# EAGLE schematic EVO256x64 (EAGLE 7.4.0)
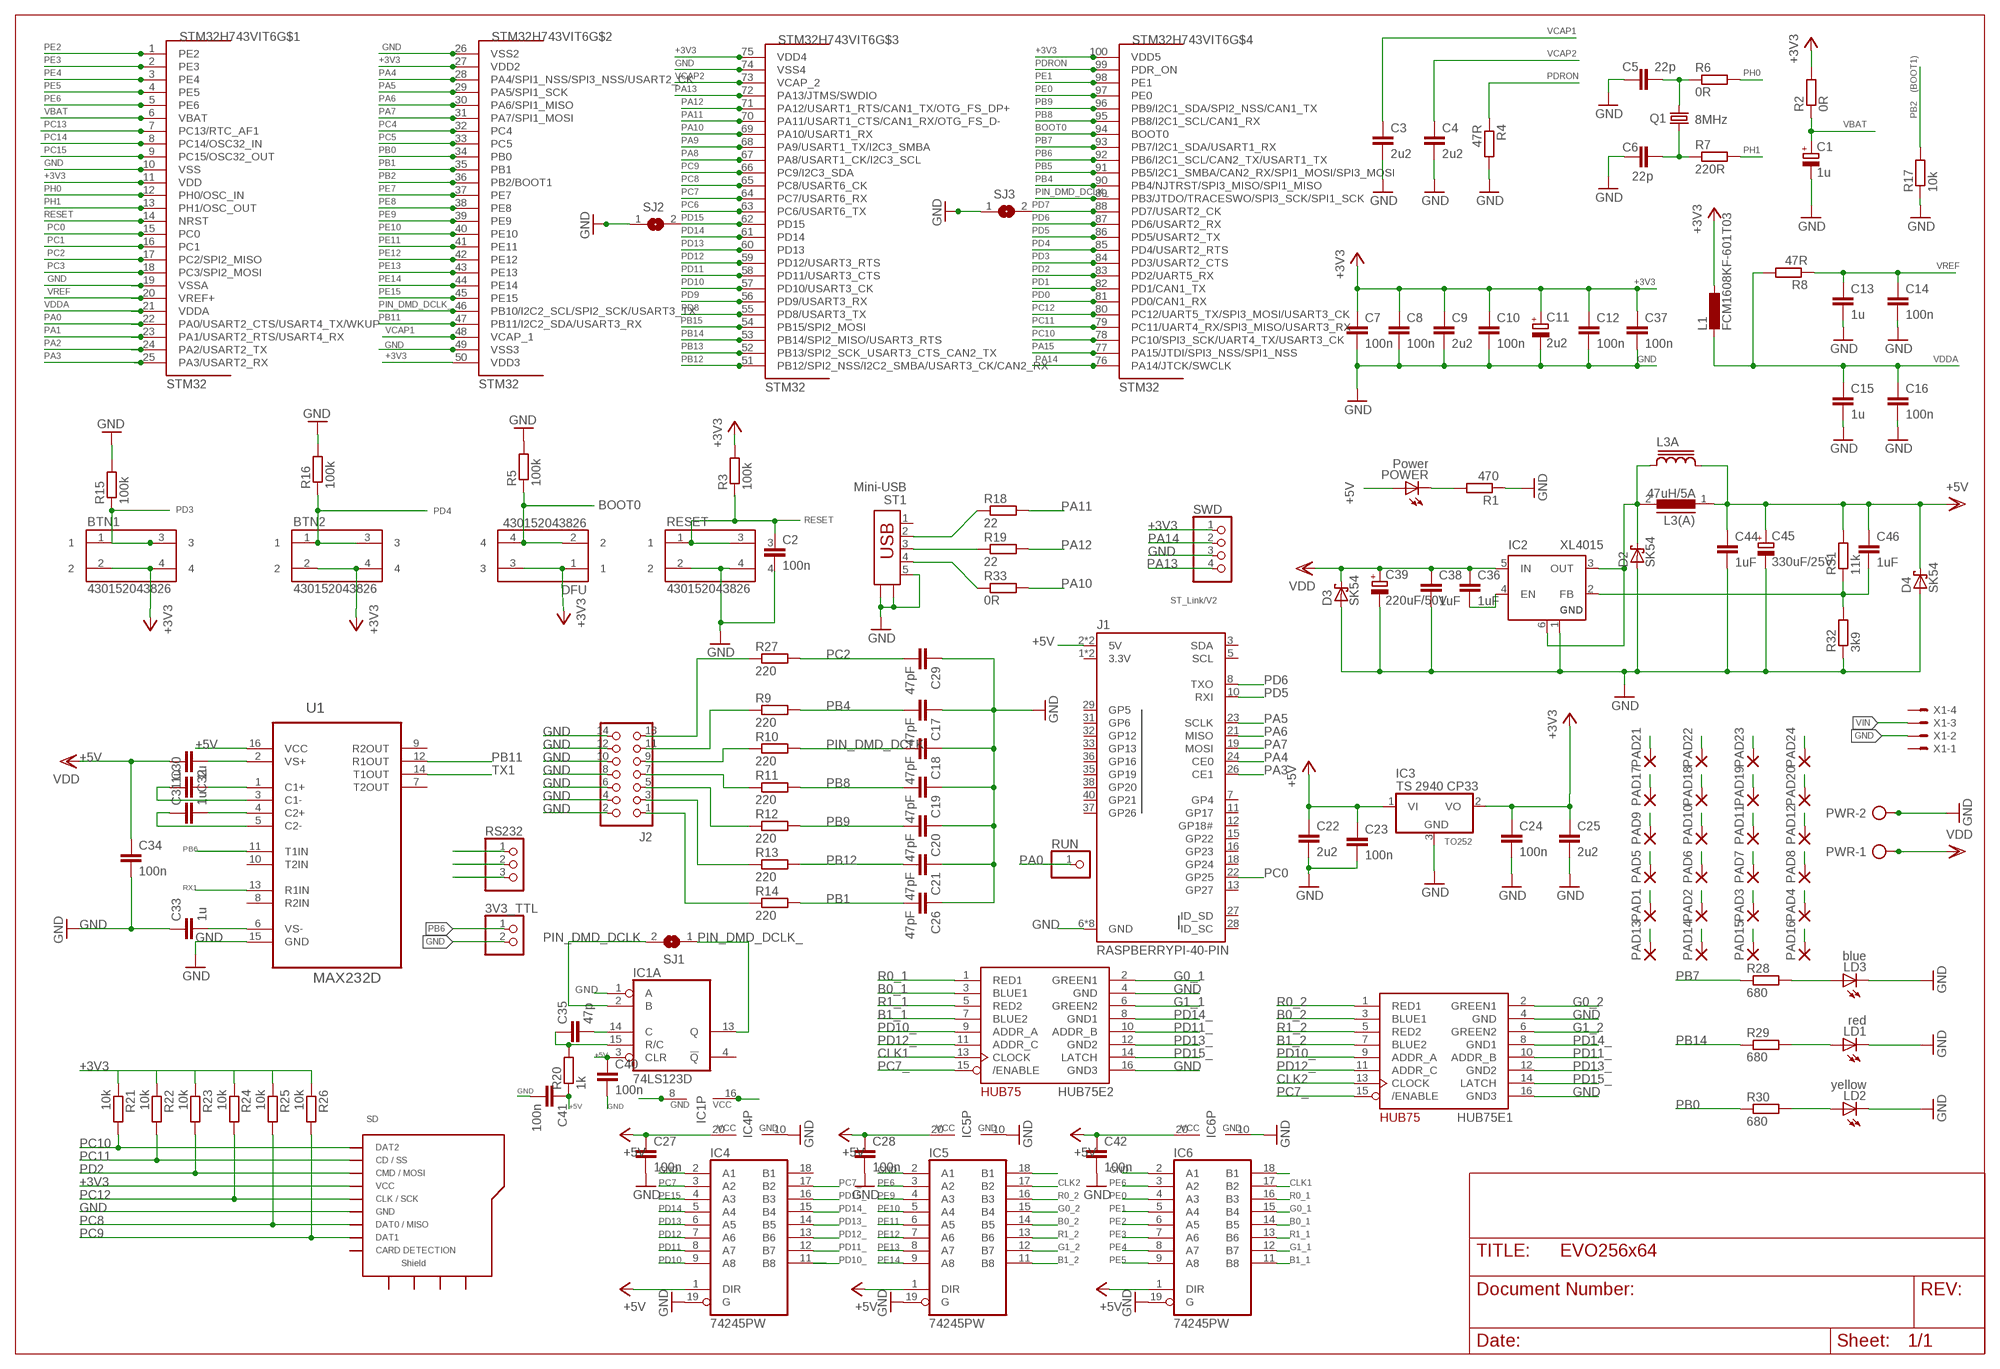
[diagram p0: schematic, sheet 1]

## Parts
3V3_TTL  PINHD-1X2  [1X02]
BTN1  430152043826  [430152043826]
BTN2  430152043826  [430152043826]
C1  1u  CPOL-EUCT3528  [CT3528]
C2  100n  C-EUC0805  [C0805]
C3  2u2  C-EUC0805  [C0805]
C4  2u2  C-EUC0805  [C0805]
C5  22p  C-EUC0805  [C0805]
C6  22p  C-EUC0805  [C0805]
C7  100n  C-EUC0805  [C0805]
C8  100n  C-EUC0805  [C0805]
C9  2u2  C-EUC1206  [C1206]
C10  100n  C-EUC0805  [C0805]
C11  2u2  CPOL-EUCT3528  [CT3528]
C12  100n  C-EUC0805  [C0805]
C13  1u  C-EUC1206  [C1206]
C14  100n  C-EUC0805  [C0805]
C15  1u  C-EUC1206  [C1206]
C16  100n  C-EUC0805  [C0805]
C17  47pF  C-EUC0805  [C0805]
C18  47pF  C-EUC0805  [C0805]
C19  47pF  C-EUC0805  [C0805]
C20  47pF  C-EUC0805  [C0805]
C21  47pF  C-EUC0805  [C0805]
C22  2u2  C-EUC1206  [C1206]
C23  100n  C-EUC0805  [C0805]
C24  100n  C-EUC0805  [C0805]
C25  2u2  C-EUC1206  [C1206]
C26  47pF  C-EUC0805  [C0805]
C27  100n  C-EUC0805  [C0805]
C28  100n  C-EUC0805  [C0805]
C29  47pF  C-EUC0805  [C0805]
C30  1u  C-EUC0805  [C0805]
C31  1u  C-EUC0805  [C0805]
C32  1u  C-EUC0805  [C0805]
C33  1u  C-EUC0805  [C0805]
C34  100n  C-EUC0805  [C0805]
C35  47p  C-EUC0805  [C0805]
C36  1uF  C-EUC1206  [C1206]
C37  100n  C-EUC0805  [C0805]
C38  1uF  C-EUC1206  [C1206]
C39  220uF/50V  CPOL-EUG  [PANASONIC_G]
C40  100n  C-EUC0805  [C0805]
C41  100n  C-EUC0805  [C0805]
C42  100n  C-EUC0805  [C0805]
C44  1uF  C-EUC1206  [C1206]
C45  330uF/25V  CPOL-EUG  [PANASONIC_G]
C46  1uF  C-EUC1206  [C1206]
D2  SK54  SCHOTTKY-DIODESMD  [SMB]
D3  SK54  SCHOTTKY-DIODESMD  [SMB]
D4  SK54  SCHOTTKY-DIODESMD  [SMB]
DFU  430152043826  [430152043826]
HUB75E1  RGB  HUB75MATRIX  [2X08-IDC]
HUB75E2  RGB  HUB75MATRIX  [2X08-IDC]
IC1  74LS123D  [SO16]
IC2  XL4015  [TO263-5]
IC3  TS 2940 CP33  7808DT  [TO252]
IC4  74245PW  [TSSOP20]
IC5  74245PW  [TSSOP20]
IC6  74245PW  [TSSOP20]
J1  RASPBERRYPI-40-PIN  RASPBERRYPI-40-PIN-GPIO_PTH_NO_SHROUD  [2X20]
J2  CON_HEADER_2X07-PTH-SHROUDED  [PINSHRD_PTH_2X07]
L1  FCM1608KF-601T03  L-EUL2012C  [L2012C]
L3(A)  47uH/5A  ED16  [ED16]
L3A  SRR1206  [SRR1206]
LD1  red  LEDCHIP-LED0805  [CHIP-LED0805]
LD2  yellow  LEDCHIP-LED0805  [CHIP-LED0805]
LD3  blue  LEDCHIP-LED0805  [CHIP-LED0805]
PAD1  SMD5  [SMD2,54-5,08]
PAD2  SMD5  [SMD2,54-5,08]
PAD3  SMD5  [SMD2,54-5,08]
PAD4  SMD5  [SMD2,54-5,08]
PAD5  SMD5  [SMD2,54-5,08]
PAD6  SMD5  [SMD2,54-5,08]
PAD7  SMD5  [SMD2,54-5,08]
PAD8  SMD5  [SMD2,54-5,08]
PAD9  SMD5  [SMD2,54-5,08]
PAD10  SMD5  [SMD2,54-5,08]
PAD11  SMD5  [SMD2,54-5,08]
PAD12  SMD5  [SMD2,54-5,08]
PAD13  SMD5  [SMD2,54-5,08]
PAD14  SMD5  [SMD2,54-5,08]
PAD15  SMD5  [SMD2,54-5,08]
PAD16  SMD5  [SMD2,54-5,08]
PAD17  SMD5  [SMD2,54-5,08]
PAD18  SMD5  [SMD2,54-5,08]
PAD19  SMD5  [SMD2,54-5,08]
PAD20  SMD5  [SMD2,54-5,08]
PAD21  SMD5  [SMD2,54-5,08]
PAD22  SMD5  [SMD2,54-5,08]
PAD23  SMD5  [SMD2,54-5,08]
PAD24  SMD5  [SMD2,54-5,08]
POWER  Power  LEDCHIPLED_0805  [CHIPLED_0805]
PWR  AK500/2-H  [AK500/2-H]
Q1  8MHz  CRYSTALHC49UP  [HC49UP]
R1  470  R-EU_R0805  [R0805]
R2  0R  R-EU_R0805  [R0805]
R3  100k  R-EU_R0805  [R0805]
R4  47R  R-EU_R0805  [R0805]
R5  100k  R-EU_R0805  [R0805]
R6  0R  R-EU_R0805  [R0805]
R7  220R  R-EU_R0805  [R0805]
R8  47R  R-EU_R0805  [R0805]
R9  220  R-EU_R0805  [R0805]
R10  220  R-EU_R0805  [R0805]
R11  220  R-EU_R0805  [R0805]
R12  220  R-EU_R0805  [R0805]
R13  220  R-EU_R0805  [R0805]
R14  220  R-EU_R0805  [R0805]
R15  100k  R-EU_R0805  [R0805]
R16  100k  R-EU_R0805  [R0805]
R17  10k  R-EU_R0805  [R0805]
R18  22  R-EU_R0805  [R0805]
R19  22  R-EU_R0805  [R0805]
R20  1k  R-EU_R0805  [R0805]
R21  10k  R-EU_R0805  [R0805]
R22  10k  R-EU_R0805  [R0805]
R23  10k  R-EU_R0805  [R0805]
R24  10k  R-EU_R0805  [R0805]
R25  10k  R-EU_R0805  [R0805]
R26  10k  R-EU_R0805  [R0805]
R27  220  R-EU_R0805  [R0805]
R28  680  R-EU_R0805  [R0805]
R29  680  R-EU_R0805  [R0805]
R30  680  R-EU_R0805  [R0805]
R31  11k  R-EU_R1206  [R1206]
R32  3k9  R-EU_R1206  [R1206]
R33  0R  R-EU_R0805  [R0805]
RESET  430152043826  [430152043826]
RS232  PINHD-1X3  [1X03]
RUN  PINHD-1X1  [1X01]
SD  MICROSD_CARD_POLLIN  [MR**-AP*03**]
SJ1  SJ  [SJ]
SJ2  SJ  [SJ]
SJ3  SJ  [SJ]
ST1  Mini-USB  UBS-MINI  [USBMINI]
STM32H743VIT6  STM32  STM32F7  [LQFP100]
SWD  PINHD-1X4  [1X04]
U1  MAX232D  [SOIC127P600X175-16N]
X1  KK-156-4  [KK-156-4]

## Nets
+3V3: BTN1.2 BTN1.4 BTN2.2 BTN2.4 C7.1 C8.1 C9.1 C10.1 C11.+ C12.1 C24.1 C25.1 C37.1 DFU.1 DFU.3 IC3.2(VO) L1.1 R2.2 R3.2 R21.1 R22.1 R23.1 R24.1 R25.1 R26.1 SD.VCC STM32H743VIT6.11(VDD) STM32H743VIT6.27(VDD2) STM32H743VIT6.50(VDD3) STM32H743VIT6.75(VDD4) STM32H743VIT6.100(VDD5) SWD.1
+5V: C22.1 C23.1 C27.1 C28.1 C32.2 C34.1 C40.1 C41.1 C42.1 C44.1 C45.+ C46.1 D4.C IC1.3(A:CLR) IC1.16(P:VCC) IC3.1(VI) IC4.1(DIR) IC4.20(VCC) IC5.1(DIR) IC5.20(VCC) IC6.1(DIR) IC6.20(VCC) J1.2(5V) J1.4(5V) L3(A).1 L3A.2 PAD1.1(P) PAD2.1(P) PAD5.1(P) PAD6.1(P) PAD9.1(P) PAD10.1(P) PAD13.1(P) PAD14.1(P) PAD17.1(P) PAD18.1(P) PAD21.1(P) PAD22.1(P) POWER.A R20.1 R31.2 U1.16(VCC) ; supply symbol labelled VDD
B0_1: HUB75E2.3(BLUE1) IC6.14(B5)
B0_2: HUB75E1.3(BLUE1) IC5.14(B5)
B1_1: HUB75E2.7(BLUE2) IC6.11(B8)
B1_2: HUB75E1.7(BLUE2) IC5.11(B8)
BOOT0: DFU.2 DFU.4 R5.1 STM32H743VIT6.94(BOOT0)
CLK1: HUB75E2.13(CLOCK) IC6.17(B2)
CLK2: HUB75E1.13(CLOCK) IC5.17(B2)
G0_1: HUB75E2.2(GREEN1) IC6.15(B4)
G0_2: HUB75E1.2(GREEN1) IC5.15(B4)
G1_1: HUB75E2.6(GREEN2) IC6.12(B7)
G1_2: HUB75E1.6(GREEN2) IC5.12(B7)
GND: 3V3_TTL.2 C1.- C2.2 C3.2 C4.2 C5.2 C6.2 C7.2 C8.2 C9.2 C10.2 C11.- C12.2 C13.2 C14.2 C15.2 C16.2 C17.1 C18.1 C19.1 C20.1 C21.1 C22.2 C23.2 C24.2 C25.2 C26.1 C27.2 C28.2 C29.1 C33.1 C34.2 C37.2 C38.2 C39.- C40.2 C41.2 C42.2 C44.2 C45.- D2.A D3.A D4.A HUB75E1.4(GND) HUB75E1.16(GND3) HUB75E2.4(GND) HUB75E2.16(GND3) IC1.1(A:A) IC1.8(P:GND) IC2.1(GND) IC3.3(GND) IC4.2(A1) IC4.10(GND) IC4.19(G) IC5.2(A1) IC5.10(GND) IC5.19(G) IC6.2(A1) IC6.10(GND) IC6.19(G) J1.6(GND) J1.9(GND) J1.14(GND) J1.20(GND) J1.25(GND) J1.30(GND) J1.34(GND) J1.39(GND) J2.2 J2.4 J2.6 J2.8 J2.10 J2.12 J2.14 LD1.C LD2.C LD3.C PAD3.1(P) PAD4.1(P) PAD7.1(P) PAD8.1(P) PAD11.1(P) PAD12.1(P) PAD15.1(P) PAD16.1(P) PAD19.1(P) PAD20.1(P) PAD23.1(P) PAD24.1(P) PWR.2 R1.1 R4.2 R5.2 R15.2 R16.2 R17.1 R32.1 RESET.2 RESET.4 RS232.2 SD.GND SJ2.1 SJ3.1 ST1.5 ST1.N1 ST1.N2 STM32H743VIT6.10(VSS) STM32H743VIT6.19(VSSA) STM32H743VIT6.26(VSS2) STM32H743VIT6.49(VSS3) STM32H743VIT6.54(PB15/SPI2_MOSI) STM32H743VIT6.74(VSS4) SWD.3 U1.15(GND) X1.2
N$1: C5.1 Q1.2 R6.1
N$2: C6.1 Q1.1 R7.1
N$3: POWER.C R1.2
N$4: J2.13 R27.1
N$5: J2.11 R9.1
N$6: J2.9 R10.1
N$7: J2.7 R11.1
N$8: J2.5 R12.1
N$9: J2.3 R13.1
N$10: C35.1 IC1.15(A:R/C) R20.2
N$11: J2.1 R14.1
N$13: C30.2 U1.1(C1+)
N$14: C30.1 U1.3(C1-)
N$15: C31.2 U1.4(C2+)
N$16: C31.1 U1.5(C2-)
N$17: C33.2 U1.6(VS-)
N$18: C32.1 U1.2(VS+)
N$19: LD1.A R29.2
N$20: D2.C IC2.3(OUT) IC2.6(TAB) L3(A).2 L3A.1
N$21: C46.2 IC2.2(FB) R31.1 R32.2
N$22: C35.2 IC1.14(A:C)
N$23: LD3.A R28.2
N$24: C36.2 IC2.4(EN)
N$25: R33.1 ST1.4
N$26: LD2.A R30.2
N$39: R19.1 ST1.3
N$40: R18.1 ST1.2
N$45: IC6.18(B1)
N$62: IC5.18(B1)
PA0: RUN.1 STM32H743VIT6.22(PA0/USART2_CTS/USART4_TX/WKUP)
PA1: STM32H743VIT6.23(PA1/USART2_RTS/USART4_RX)
PA2: STM32H743VIT6.24(PA2/USART2_TX)
PA3: J1.26(CE1) STM32H743VIT6.25(PA3/USART2_RX)
PA4: J1.24(CE0) STM32H743VIT6.28(PA4/SPI1_NSS/SPI3_NSS/USART2_CK)
PA5: J1.23(SCLK) STM32H743VIT6.29(PA5/SPI1_SCK)
PA6: J1.21(MISO) STM32H743VIT6.30(PA6/SPI1_MISO)
PA7: J1.19(MOSI) STM32H743VIT6.31(PA7/SPI1_MOSI)
PA8: STM32H743VIT6.67(PA8/USART1_CK/I2C3_SCL)
PA9: STM32H743VIT6.68(PA9/USART1_TX/I2C3_SMBA)
PA10: R33.2 STM32H743VIT6.69(PA10/USART1_RX)
PA11: R18.2 STM32H743VIT6.70(PA11/USART1_CTS/CAN1_RX/OTG_FS_D-)
PA12: R19.2 STM32H743VIT6.71(PA12/USART1_RTS/CAN1_TX/OTG_FS_DP+)
PA13: STM32H743VIT6.72(PA13/JTMS/SWDIO) SWD.4
PA14: STM32H743VIT6.76(PA14/JTCK/SWCLK) SWD.2
PA15: STM32H743VIT6.77(PA15/JTDI/SPI3_NSS/SPI1_NSS)
PB0: R30.1 STM32H743VIT6.34(PB0)
PB1: C26.2 R14.2 STM32H743VIT6.35(PB1)
PB2: R17.2 STM32H743VIT6.36(PB2/BOOT1)
PB4: C17.2 R9.2 STM32H743VIT6.90(PB4/NJTRST/SPI3_MISO/SPI1_MISO)
PB5: STM32H743VIT6.91(PB5/I2C1_SMBA/CAN2_RX/SPI1_MOSI/SPI3_MOSI)
PB6: 3V3_TTL.1 STM32H743VIT6.92(PB6/I2C1_SCL/CAN2_TX/USART1_TX) U1.11(T1IN)
PB7: R28.1 STM32H743VIT6.93(PB7/I2C1_SDA/USART1_RX)
PB8: C19.2 R11.2 STM32H743VIT6.95(PB8/I2C1_SCL/CAN1_RX)
PB9: C20.2 R12.2 STM32H743VIT6.96(PB9/I2C1_SDA/SPI2_NSS/CAN1_TX)
PB11: STM32H743VIT6.47(PB11/I2C2_SDA/USART3_RX) U1.12(R1OUT)
PB12: C21.2 R13.2 STM32H743VIT6.51(PB12/SPI2_NSS/I2C2_SMBA/USART3_CK/CAN2_RX)
PB13: STM32H743VIT6.52(PB13/SPI2_SCK_USART3_CTS_CAN2_TX)
PB14: R29.1 STM32H743VIT6.53(PB14/SPI2_MISO/USART3_RTS)
PC0: J1.22(GP25) STM32H743VIT6.15(PC0)
PC1: STM32H743VIT6.16(PC1)
PC2: C29.2 R27.2 STM32H743VIT6.17(PC2/SPI2_MISO)
PC3: STM32H743VIT6.18(PC3/SPI2_MOSI)
PC4: STM32H743VIT6.32(PC4)
PC5: STM32H743VIT6.33(PC5)
PC6: STM32H743VIT6.63(PC6/USART6_TX)
PC7: IC4.3(A2) STM32H743VIT6.64(PC7/USART6_RX)
PC7_: HUB75E1.15(/ENABLE) HUB75E2.15(/ENABLE) IC4.17(B2)
PC8: R25.2 SD.DAT0(DAT0/MISO) STM32H743VIT6.65(PC8/USART6_CK)
PC9: R26.2 SD.DAT1 STM32H743VIT6.66(PC9/I2C3_SDA)
PC10: R21.2 SD.DAT2 STM32H743VIT6.78(PC10/SPI3_SCK/UART4_TX/USART3_CK)
PC11: R22.2 SD.DAT3/CS(CD/SS) STM32H743VIT6.79(PC11/UART4_RX/SPI3_MISO/USART3_RX)
PC12: R24.2 SD.CLK(CLK/SCK) STM32H743VIT6.80(PC12/UART5_TX/SPI3_MOSI/USART3_CK)
PC13: STM32H743VIT6.7(PC13/RTC_AF1)
PC14: STM32H743VIT6.8(PC14/OSC32_IN)
PC15: STM32H743VIT6.9(PC15/OSC32_OUT)
PD0: STM32H743VIT6.81(PD0/CAN1_RX)
PD1: STM32H743VIT6.82(PD1/CAN1_TX)
PD2: R23.2 SD.CMD(CMD/MOSI) STM32H743VIT6.83(PD2/UART5_RX)
PD3: BTN1.1 BTN1.3 R15.1 STM32H743VIT6.84(PD3/USART2_CTS)
PD4: BTN2.1 BTN2.3 R16.1 STM32H743VIT6.85(PD4/USART2_RTS)
PD5: J1.10(RXI) STM32H743VIT6.86(PD5/USART2_TX)
PD6: J1.8(TXO) STM32H743VIT6.87(PD6/USART2_RX)
PD7: SJ3.2 STM32H743VIT6.88(PD7/USART2_CK)
PD8: STM32H743VIT6.55(PD8/USART3_TX)
PD9: STM32H743VIT6.56(PD9/USART3_RX)
PD10: IC4.9(A8) STM32H743VIT6.57(PD10/USART3_CK)
PD10_: HUB75E1.9(ADDR_A) HUB75E2.9(ADDR_A) IC4.11(B8)
PD11: IC4.8(A7) STM32H743VIT6.58(PD11/USART3_CTS)
PD11_: HUB75E1.10(ADDR_B) HUB75E2.10(ADDR_B) IC4.12(B7)
PD12: IC4.7(A6) STM32H743VIT6.59(PD12/USART3_RTS)
PD12_: HUB75E1.11(ADDR_C) HUB75E2.11(ADDR_C) IC4.13(B6)
PD13: IC4.6(A5) STM32H743VIT6.60(PD13)
PD13_: HUB75E1.12(GND2) HUB75E2.12(GND2) IC4.14(B5)
PD14: IC4.5(A4) STM32H743VIT6.61(PD14)
PD14_: HUB75E1.8(GND1) HUB75E2.8(GND1) IC4.15(B4)
PD15: SJ2.2 STM32H743VIT6.62(PD15)
PD15_: HUB75E1.14(LATCH) HUB75E2.14(LATCH) IC4.16(B3)
PDRON: R4.1 STM32H743VIT6.99(PDR_ON)
PE0: IC6.4(A3) STM32H743VIT6.97(PE0)
PE1: IC6.5(A4) STM32H743VIT6.98(PE1)
PE2: IC6.6(A5) STM32H743VIT6.1(PE2)
PE3: IC6.7(A6) STM32H743VIT6.2(PE3)
PE4: IC6.8(A7) STM32H743VIT6.3(PE4)
PE5: IC6.9(A8) STM32H743VIT6.4(PE5)
PE6: IC5.3(A2) IC6.3(A2) STM32H743VIT6.5(PE6)
PE7: STM32H743VIT6.37(PE7)
PE8: STM32H743VIT6.38(PE8)
PE9: IC5.4(A3) STM32H743VIT6.39(PE9)
PE10: IC5.5(A4) STM32H743VIT6.40(PE10)
PE11: IC5.6(A5) STM32H743VIT6.41(PE11)
PE12: IC5.7(A6) STM32H743VIT6.42(PE12)
PE13: IC5.8(A7) STM32H743VIT6.43(PE13)
PE14: IC5.9(A8) STM32H743VIT6.44(PE14)
PE15: IC4.4(A3) STM32H743VIT6.45(PE15)
PH0: R6.2 STM32H743VIT6.12(PH0/OSC_IN)
PH1: R7.2 STM32H743VIT6.13(PH1/OSC_OUT)
PIN_DMD_DCLK: C18.2 IC1.2(A:B) R10.2 SJ1.2
PIN_DMD_DCLK_: IC1.13(A:Q) SJ1.1 STM32H743VIT6.46(PB10/I2C2_SCL/SPI2_SCK/USART3_TX) STM32H743VIT6.89(PB3/JTDO/TRACESWO/SPI3_SCK/SPI1_SCK)
R0_1: HUB75E2.1(RED1) IC6.16(B3)
R0_2: HUB75E1.1(RED1) IC5.16(B3)
R1_1: HUB75E2.5(RED2) IC6.13(B6)
R1_2: HUB75E1.5(RED2) IC5.13(B6)
RESET: C2.1 R3.1 RESET.1 RESET.3 STM32H743VIT6.14(NRST)
RX1: RS232.3 U1.13(R1IN)
TX1: RS232.1 U1.14(T1OUT)
VBAT: C1.+ R2.1 STM32H743VIT6.6(VBAT)
VCAP1: C3.1 STM32H743VIT6.48(VCAP_1)
VCAP2: C4.1 STM32H743VIT6.73(VCAP_2)
VDDA: C15.1 C16.1 L1.2 R8.2 STM32H743VIT6.21(VDDA)
VIN: C36.1 C38.1 C39.+ D3.C IC2.5(IN) PWR.1 X1.3 ; supply symbol labelled VDD
VREF: C13.1 C14.1 R8.1 STM32H743VIT6.20(VREF+)
Unconnected: IC1.4(A:!Q) IC1.5(B:Q) IC1.6(B:C) IC1.7(B:R/C) IC1.9(B:A) IC1.10(B:B) IC1.11(B:CLR) IC1.12(B:!Q) IC4.18(B1) J1.3(SDA) J1.5(SCL) J1.7(GP4) J1.11(GP17) J1.12(GP18#) J1.13(GP27) J1.15(GP22) J1.16(GP23) J1.18(GP24) J1.27(ID_SD) J1.28(ID_SC) J1.29(GP5) J1.31(GP6) J1.32(GP12) J1.33(GP13) J1.35(GP19) J1.36(GP16) J1.37(GP26) J1.38(GP20) J1.40(GP21) SD.CARD_DETECTION(CARD_D) SD.SHD_1(SHD1) SD.SHD_2(SHD2) SD.SHD_3(SHD3) SD.SHD_4(SHD4) ST1.1 U1.7(T2OUT) U1.8(R2IN) U1.9(R2OUT) U1.10(T2IN) X1.1 X1.4

## Notes on the sheet
- (BOOT1)
- PB15
- ST_Link/V2
- TO252

## Power pins joined to a net without a drawn wire
3.3V: J1.1(3.3V) J1.17(3.3V)

## Library data of the parts
3V3_TTL = pinhead:PINHD-1X2: PIN HEADER
BTN1 BTN2 DFU RESET = Switches_rev16a:430152043826: WS-TSS-6x6 mm SMD Tact Switch,4 pins
C1 C11 = rcl:CPOL-EU: POLARIZED CAPACITOR, European symbol
C2 C5-C8 C10 C12 C16 C23 C24 C37 = rcl:C-EU: CAPACITOR, European symbol
C3 C4 C9 C13-C15 C17-C22 C25-C36 C38 C40-C42 C44 C46 = resistor:C-EU: CAPACITOR, European symbol
C39 C45 = resistor:CPOL-EU: POLARIZED CAPACITOR, European symbol
D2-D4 = diode:SCHOTTKY-DIODE: Schottky Diode
HUB75E1 HUB75E2 = adafruit:HUB75MATRIX
IC1 = 74xx-eu:74*123: Retriggerable monostable MULTIVIBRATOR
IC2 = linear4:XL4015
IC3 = linear:78*: Positive VOLTAGE REGULATOR Source: http://cache.national.com/ds/LM/LM78L05.pdf http://www.fairchildsemi.com/ds/LM/LM7805.pdf
IC4-IC6 = 74xx-eu:74*245: Octal BUS TRANSCEIVER, 3-state
J1 = SparkFun-Connectors:RASPBERRYPI-40-PIN-GPIO: Raspberry Pi GPIO Header 2x20 pin connector, as found on B, B+, A+ models. Both shrouded PTH and SMT versions available. SparkFun Products: GPIO Shrouded Header <https://www.sparkfun.com/products/13054>- PTH SparkFun Pi Wedge (Preassembled) <https://www.sparkfun.com/products/13717>
J2 = dp_devices.v6:CON_HEADER_2X07: 2x07 pin header
L1 = rcl:L-EU: INDUCTOR, European symbol
L3(A) = inductors:ED16: INDUCTOR
L3A = inductor-bourns:SRR1206: POWER INDUCTOR
LD1-LD3 = adafruit:LED: LED
PAD1-PAD24 = wirepad:SMD5: SMD PAD
POWER = led:LED: LED
PWR = con-ptr500:AK500/2-H: CONNECTOR Aug. 2004 / PTR Meßtechnik: Die Bezeichnung der Serie AK505 wurde geändert. Es handelt sich hierbei um AK500 in horizontaler Ausführung.; OC_FARNELL: unknown; OC_NEWARK: unknown
Q1 = crystal:CRYSTAL: CRYSTAL; OC_FARNELL: unknown; OC_NEWARK: unknown
R1 R2 R4 R6-R8 R17 R20 = rcl:R-EU_: RESISTOR, European symbol
R3 R5 R9-R16 R18 R19 R21-R33 = resistor:R-EU_: RESISTOR, European symbol
RS232 = pinhead:PINHD-1X3: PIN HEADER
RUN = pinhead:PINHD-1X1: PIN HEADER
SD = 000_eigene_Bauteile:MICROSD_CARD_POLLIN
SJ1-SJ3 = jumper:SJ: SMD solder JUMPER
ST1 = con-amp:UBS-MINI
STM32H743VIT6 = STM32F407Vx_LQFP100:STM32F7: STmicroelectronics Cortex M7 Series Typ: STM32F7 LQFP100 Copyright 2012 by Ersan Günes, Quantitec, info@quantitec.de
SWD = pinhead:PINHD-1X4: PIN HEADER
U1 = MAX232D:MAX232D: DUAL EIA-232 DRIVERS/RECEIVERS
X1 = con-molex:KK-156-4: KK 156 HEADER Source: http://www.molex.com/pdm_docs/sd/026604100_sd.pdf; OC_FARNELL: unknown; OC_NEWARK: unknown